# EAGLE design controller (EAGLE 9.5.2)

## Sheet 1 of 4: Main
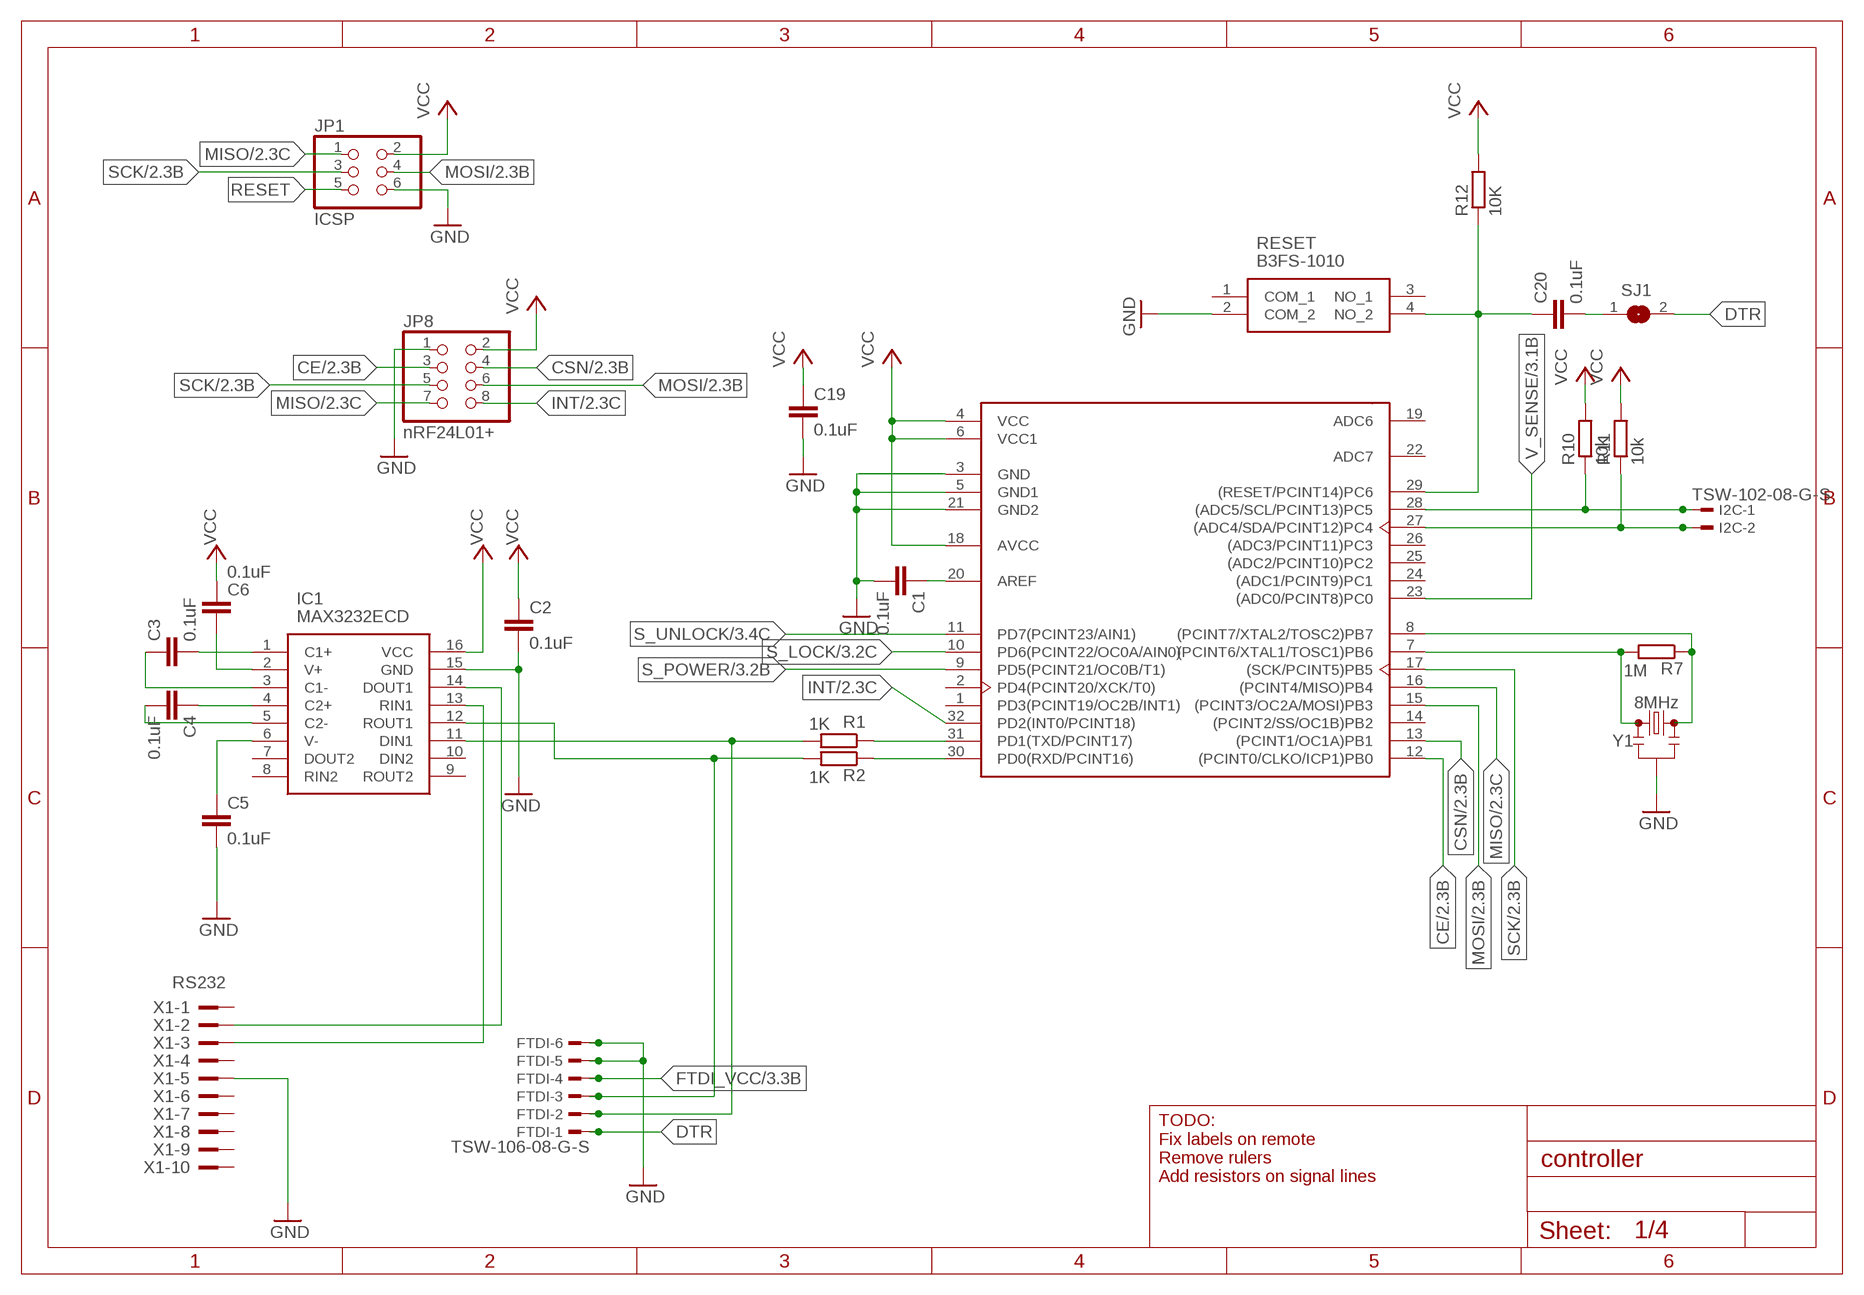
[diagram p0: schematic, sheet 1]

### Parts
C1  0.1uF  C-EUC0805  [C0805]
C2  0.1uF  C-EUC0805  [C0805]
C3  0.1uF  C-EUC0805  [C0805]
C4  0.1uF  C-EUC0805  [C0805]
C5  0.1uF  C-EUC0805  [C0805]
C6  0.1uF  C-EUC0805  [C0805]
C19  0.1uF  C-EUC0805  [C0805]
C20  0.1uF  C-EUC0805  [C0805]
FTDI  TSW-106-08-G-S  [TSW-106-XX-G-S]
I2C  TSW-102-08-G-S  [TSW-102-XX-G-S]
IC1  MAX3232ECD  [SOIC127P600X175-16N]
JP1  ICSP  PINHD-2X3  [2X03]
JP8  nRF24L01+  PINHD-2X4  [2X04]
R1  1K  R-EU_R0805  [R0805]
R2  1K  R-EU_R0805  [R0805]
R7  1M  R-EU_R0805  [R0805]
R10  10k  R-EU_R0805  [R0805]
R11  10k  R-EU_R0805  [R0805]
R12  10K  R-EU_R0805  [R0805]
RESET  B3FS-1010  [B3FS-1000P]
SJ1  SJ  [SJ]
U2  ATMEGA328P-AU  [TQFP-32]
X1  RS232  2510-  [PAK100/2500-10]
Y1  8MHz  RESONATOR-8MHZSMD_3.2X1.3  [RESONATOR-SMD-3.2X1.3]

### Nets
CE: JP8.3 U2.12((PCINT0/CLKO/ICP1)PB0) ; also sheet 2
CSN: JP8.4 U2.13((PCINT1/OC1A)PB1) ; also sheet 2
DTR: FTDI.1 SJ1.2
FTDI_VCC: FTDI.4 ; also sheet 3
GND: C1.2 C2.2 C5.2 C19.2 FTDI.5 FTDI.6 IC1.15(GND) JP1.6 JP8.1 RESET.2(COM_2) U2.3(GND) U2.5(GND1) U2.21(GND2) X1.5 Y1.2 ; also sheet 2,3
INT: JP8.8 U2.32(PD2(INT0/PCINT18)) ; also sheet 2
MISO: JP1.1 JP8.7 U2.16((PCINT4/MISO)PB4) ; also sheet 2
MOSI: JP1.4 JP8.6 U2.15((PCINT3/OC2A/MOSI)PB3) ; also sheet 2
N$1: C1.1 U2.20(AREF)
N$2: R7.2 U2.7((PCINT6/XTAL1/TOSC1)PB6) Y1.1
N$3: R7.1 U2.8((PCINT7/XTAL2/TOSC2)PB7) Y1.3
N$4: R1.1 U2.31(PD1(TXD/PCINT17))
N$5: R2.1 U2.30(PD0(RXD/PCINT16))
N$6: C5.1 IC1.6(V-)
N$7: C3.2 IC1.1(C1+)
N$8: C4.2 IC1.5(C2-)
N$9: C3.1 IC1.3(C1-)
N$10: C4.1 IC1.4(C2+)
N$11: C6.1 IC1.2(V+)
N$12: IC1.13(RIN1) X1.3
N$13: IC1.14(DOUT1) X1.2
N$28: C20.2 SJ1.1
RESET: C20.1 JP1.5 R12.1 RESET.4(NO_2) U2.29((RESET/PCINT14)PC6)
RX-I: FTDI.3 IC1.12(ROUT1) R2.2
S_LOCK: U2.10(PD6(PCINT22/OC0A/AIN0)) ; also sheet 3
S_POWER: U2.9(PD5(PCINT21/OC0B/T1)) ; also sheet 3
S_UNLOCK: U2.11(PD7(PCINT23/AIN1)) ; also sheet 3
SCK: JP1.3 JP8.5 U2.17((SCK/PCINT5)PB5) ; also sheet 2
SCL: I2C.1 R10.1 U2.28((ADC5/SCL/PCINT13)PC5)
SDA: I2C.2 R11.1 U2.27((ADC4/SDA/PCINT12)PC4)
TX-O: FTDI.2 IC1.11(DIN1) R1.2
V_SENSE: U2.23((ADC0/PCINT8)PC0) ; also sheet 3
VCC: C2.1 C6.2 C19.1 IC1.16(VCC) JP1.2 JP8.2 R10.2 R11.2 R12.2 U2.4(VCC) U2.6(VCC1) U2.18(AVCC) ; also sheet 2,3
Unconnected: IC1.7(DOUT2) IC1.8(RIN2) IC1.9(ROUT2) IC1.10(DIN2) RESET.1(COM_1) RESET.3(NO_1) U2.1(PD3(PCINT19/OC2B/INT1)) U2.2(PD4(PCINT20/XCK/T0)) U2.14((PCINT2/SS/OC1B)PB2) U2.19(ADC6) U2.22(ADC7) U2.24((ADC1/PCINT9)PC1) U2.25((ADC2/PCINT10)PC2) U2.26((ADC3/PCINT11)PC3) X1.1 X1.4 X1.6 X1.7 X1.8 X1.9 X1.10

### Notes on the sheet
- TODO:
  Fix labels on remote
  Remove rulers
  Add resistors on signal lines

## Sheet 2 of 4: Wireless
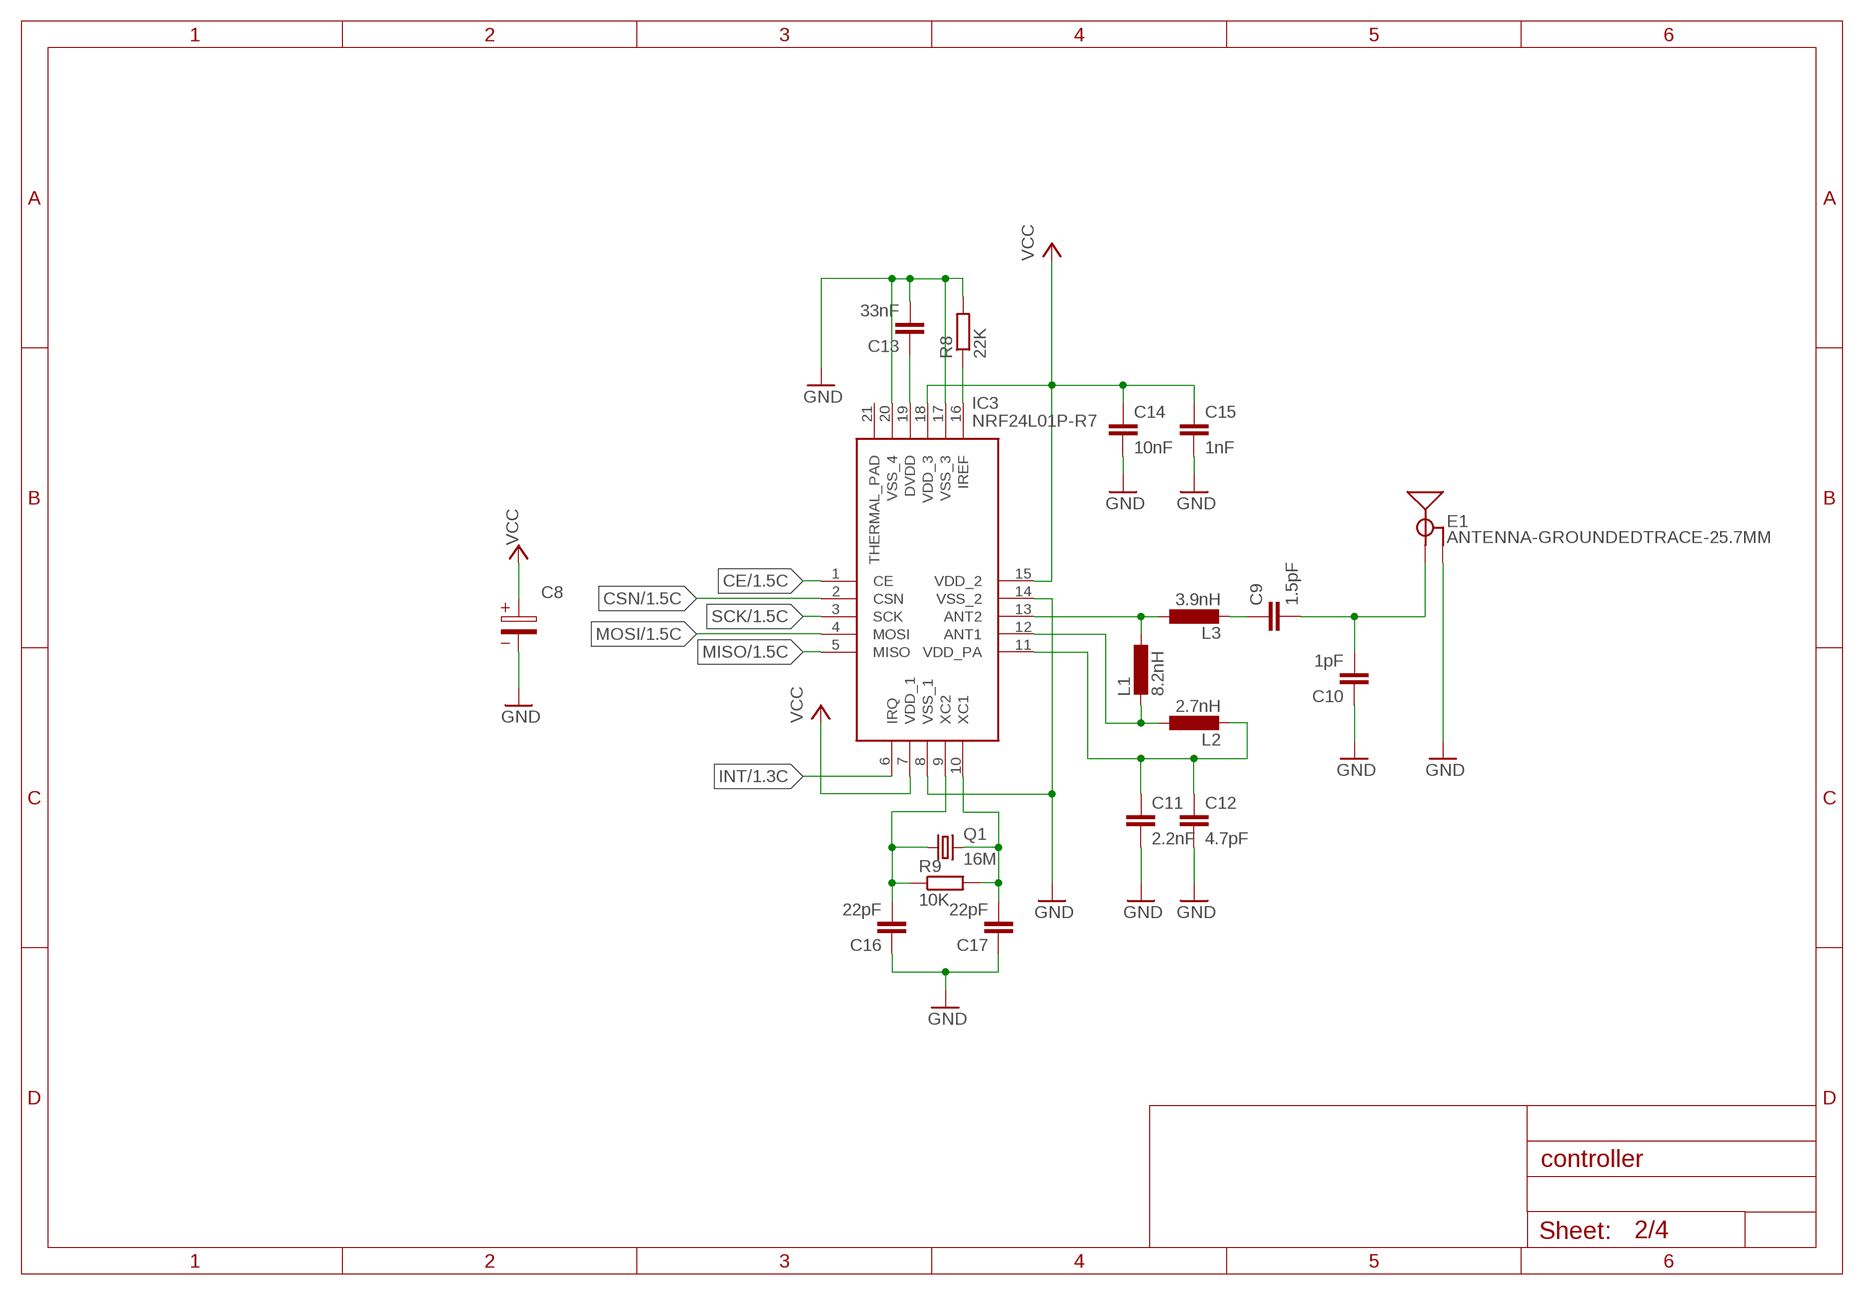
[diagram p1: schematic, sheet 2]

### Parts
C8  WCAP-ASLI_8X6,5_865080149011  [4.2X1.9X2.8(BXCXA)]
C9  1.5pF  C-EUC0805  [C0805]
C10  1pF  C-EUC0805  [C0805]
C11  2.2nF  C-EUC0805  [C0805]
C12  4.7pF  C-EUC0805  [C0805]
C13  33nF  C-EUC0805  [C0805]
C14  10nF  C-EUC0805  [C0805]
C15  1nF  C-EUC0805  [C0805]
C16  22pF  C-EUC0805  [C0805]
C17  22pF  C-EUC0805  [C0805]
E1  ANTENNA-GROUNDEDTRACE-25.7MM  [TRACE_ANTENNA_2.4GHZ_25.7MM]
IC3  NRF24L01P-R7  [QFN50P400X400X95-21N]
L1  8.2nH  L-EUL2012C  [L2012C]
L2  2.7nH  L-EUL2012C  [L2012C]
L3  3.9nH  L-EUL2012C  [L2012C]
Q1  16M  CRYSTALHC49S  [HC49/S]
R8  22K  R-EU_R0805  [R0805]
R9  10K  R-EU_R0805  [R0805]

### Nets
CE: IC3.1(CE) ; also sheet 1
CSN: IC3.2(CSN) ; also sheet 1
GND: C8.2 C10.1 C11.2 C12.2 C13.2 C14.2 C15.2 C16.1 C17.1 E1.GND E1.GND2(GND) IC3.8(VSS_1) IC3.14(VSS_2) IC3.17(VSS_3) IC3.20(VSS_4) R8.2 ; also sheet 1,3
INT: IC3.6(IRQ) ; also sheet 1
MISO: IC3.5(MISO) ; also sheet 1
MOSI: IC3.4(MOSI) ; also sheet 1
N$14: IC3.13(ANT2) L1.1 L3.1
N$15: IC3.12(ANT1) L1.2 L2.1
N$16: C11.1 C12.1 IC3.11(VDD_PA) L2.2
N$17: C9.1 L3.2
N$18: C9.2 C10.2 E1.ANT(SIGNAL)
N$19: C13.1 IC3.19(DVDD)
N$21: C16.2 IC3.9(XC2) Q1.1 R9.1
N$22: C17.2 IC3.10(XC1) Q1.2 R9.2
N$23: IC3.16(IREF) R8.1
SCK: IC3.3(SCK) ; also sheet 1
VCC: C8.1 C14.1 C15.1 IC3.7(VDD_1) IC3.15(VDD_2) IC3.18(VDD_3) ; also sheet 1,3
Unconnected: IC3.21(THERMAL_PAD)

## Sheet 3 of 4: Power / Control
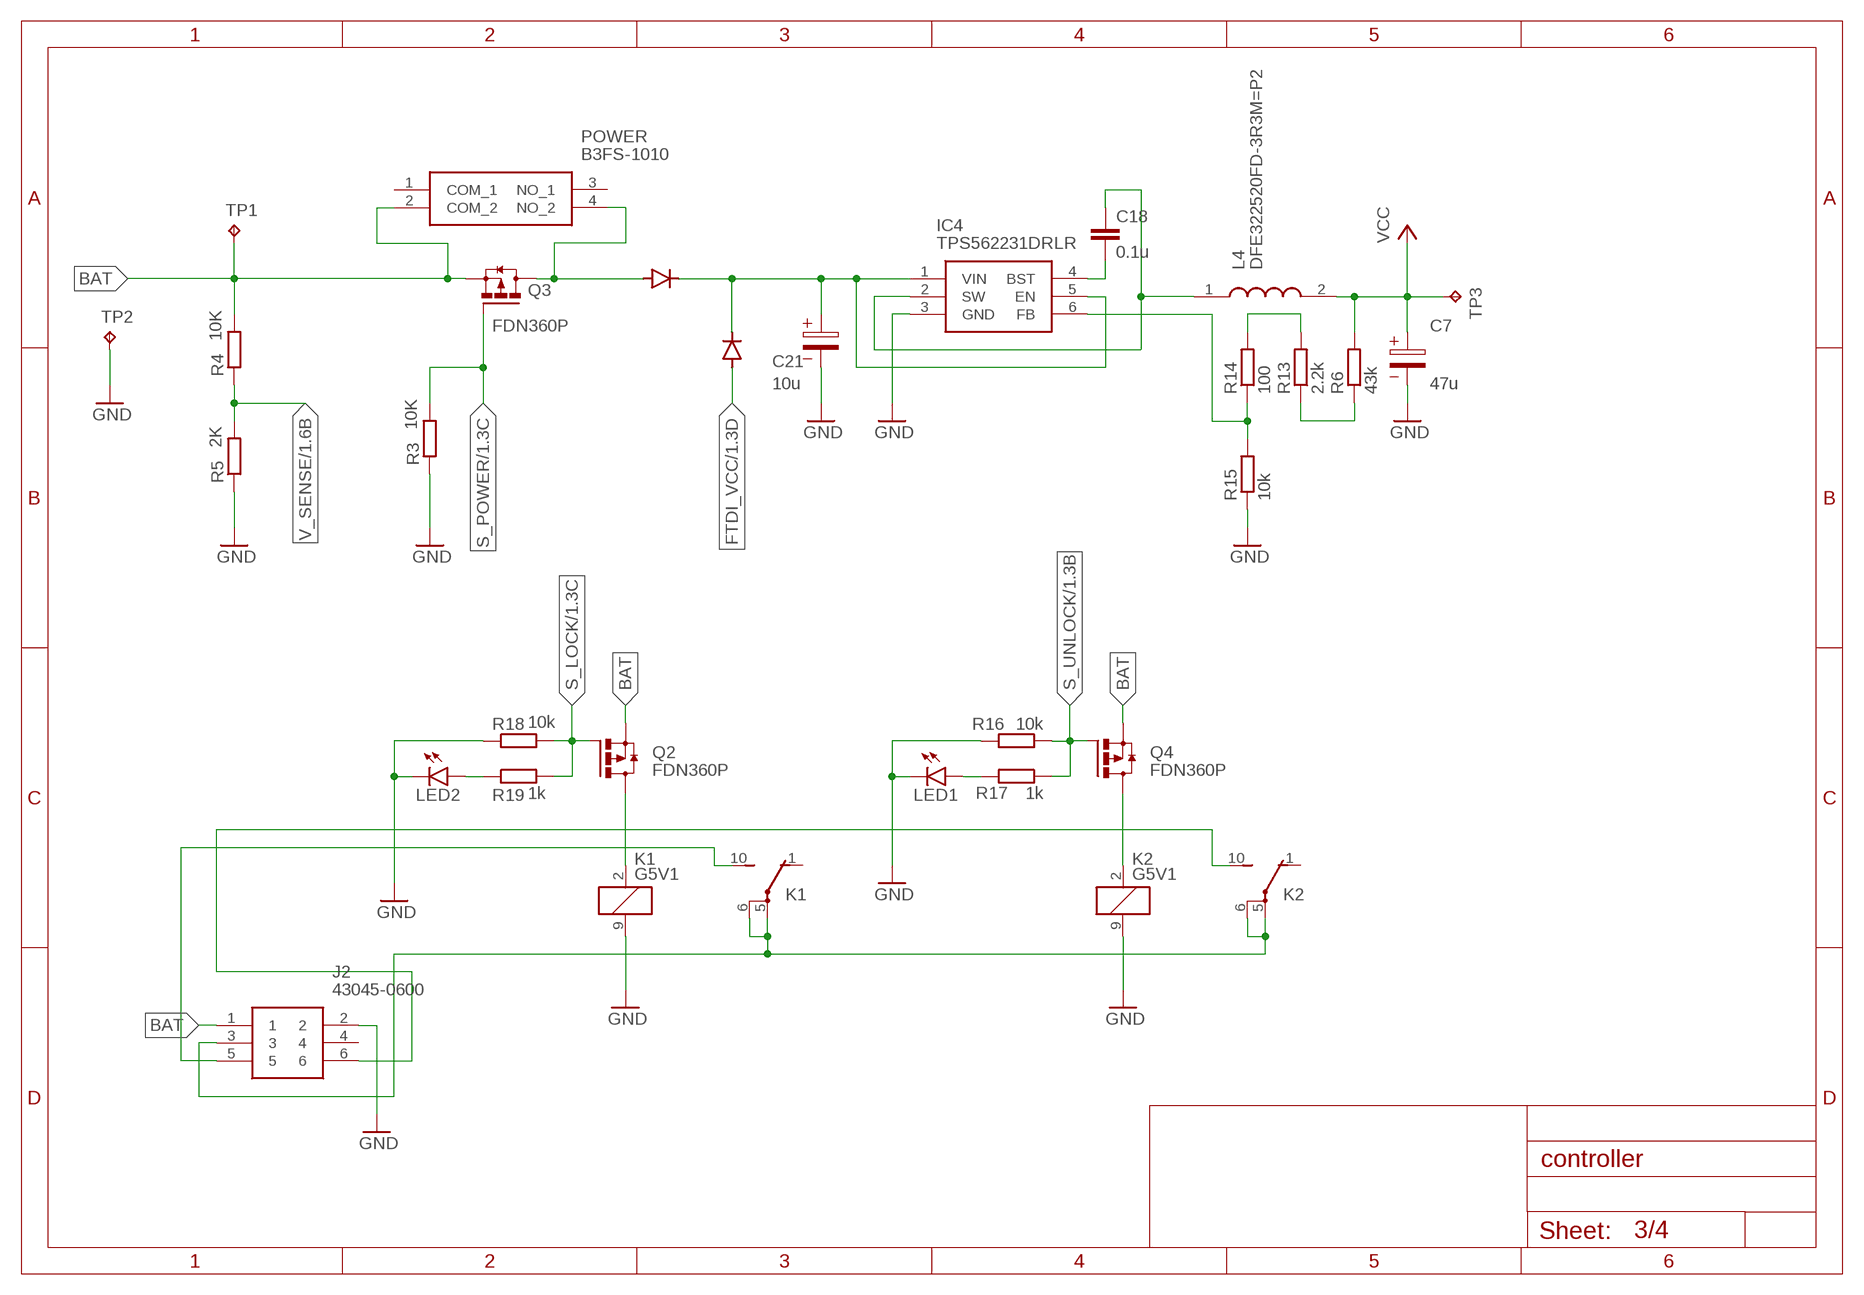
[diagram p2: schematic, sheet 3]

### Parts
C7  47u  WCAP-ASLI_4X5,5_865080140004  [2.6X1.6X1(BXCXA)]
C18  0.1u  C-EUC0805  [C0805]
C21  10u  WCAP-ASLI_4X5,5_865080340001  [2.6X1.6X1(BXCXA)]
D1  DIODE-SOD123  [SOD123]
D2  DIODE-SOD123  [SOD123]
IC4  TPS562231DRLR  [SOTFL50P160X60-6N]
J2  43045-0600  [43045-0600]
K1  G5V1  [G5V1]
K2  G5V1  [G5V1]
L4  DFE322520FD-3R3M=P2  [INDC3225X200N]
LED1  LEDCHIPLED_0805  [CHIPLED_0805]
LED2  LEDCHIPLED_0805  [CHIPLED_0805]
POWER  B3FS-1010  [B3FS-1000P]
Q2  FDN360P  [SUPER-SOT3]
Q3  FDN360P  [SUPER-SOT3]
Q4  FDN360P  [SUPER-SOT3]
R3  10K  R-EU_R0805  [R0805]
R4  10K  R-EU_R0805  [R0805]
R5  2K  R-EU_R0805  [R0805]
R6  43k  R-EU_R0805  [R0805]
R13  2.2k  R-EU_R0805  [R0805]
R14  100  R-EU_R0805  [R0805]
R15  10k  R-EU_R0805  [R0805]
R16  10k  R-EU_R0805  [R0805]
R17  1k  R-EU_R0805  [R0805]
R18  10k  R-EU_R0805  [R0805]
R19  1k  R-EU_R0805  [R0805]
TP1  TPB1,27  [B1,27]
TP2  TPB1,27  [B1,27]
TP3  TPB1,27  [B1,27]

### Nets
BAT: J2.1 POWER.2(COM_2) Q2.2(S) Q3.2(S) Q4.2(S) R4.2 TP1.TP
E_LOCK: J2.5 K1.10(2:S)
E_UNLOCK: J2.6 K2.10(2:S)
FTDI_VCC: D1.A ; also sheet 1
GND: C7.2 C21.2 IC4.3(GND) J2.2 K1.9 K2.9 LED1.C LED2.C R3.1 R5.1 R15.1 R16.2 R18.1 TP2.TP ; also sheet 1,2
N$24: C18.1 IC4.2(SW) L4.1
N$25: C18.2 IC4.4(BST)
N$26: R13.2 R14.2
N$27: C21.1 D1.C D2.C IC4.1(VIN) IC4.5(EN)
N$29: J2.3 K1.5(2:P) K1.6(2:P) K2.5(2:P) K2.6(2:P)
N$30: R6.1 R13.1
N$31: IC4.6(FB) R14.1 R15.2
N$33: D2.A POWER.4(NO_2) Q3.3(D)
N$34: K1.2 Q2.3(D)
N$35: K2.2 Q4.3(D)
N$37: LED1.A R17.2
N$39: LED2.A R19.1
S_LOCK: Q2.1(G) R18.2 R19.2 ; also sheet 1
S_POWER: Q3.1(G) R3.2 ; also sheet 1
S_UNLOCK: Q4.1(G) R16.1 R17.1 ; also sheet 1
V_SENSE: R4.1 R5.2 ; also sheet 1
VCC: C7.1 L4.2 R6.2 TP3.TP ; also sheet 1,2
Unconnected: J2.4 K1.1(2:O) K2.1(2:O) POWER.1(COM_1) POWER.3(NO_1)

## Sheet 4 of 4: Remote
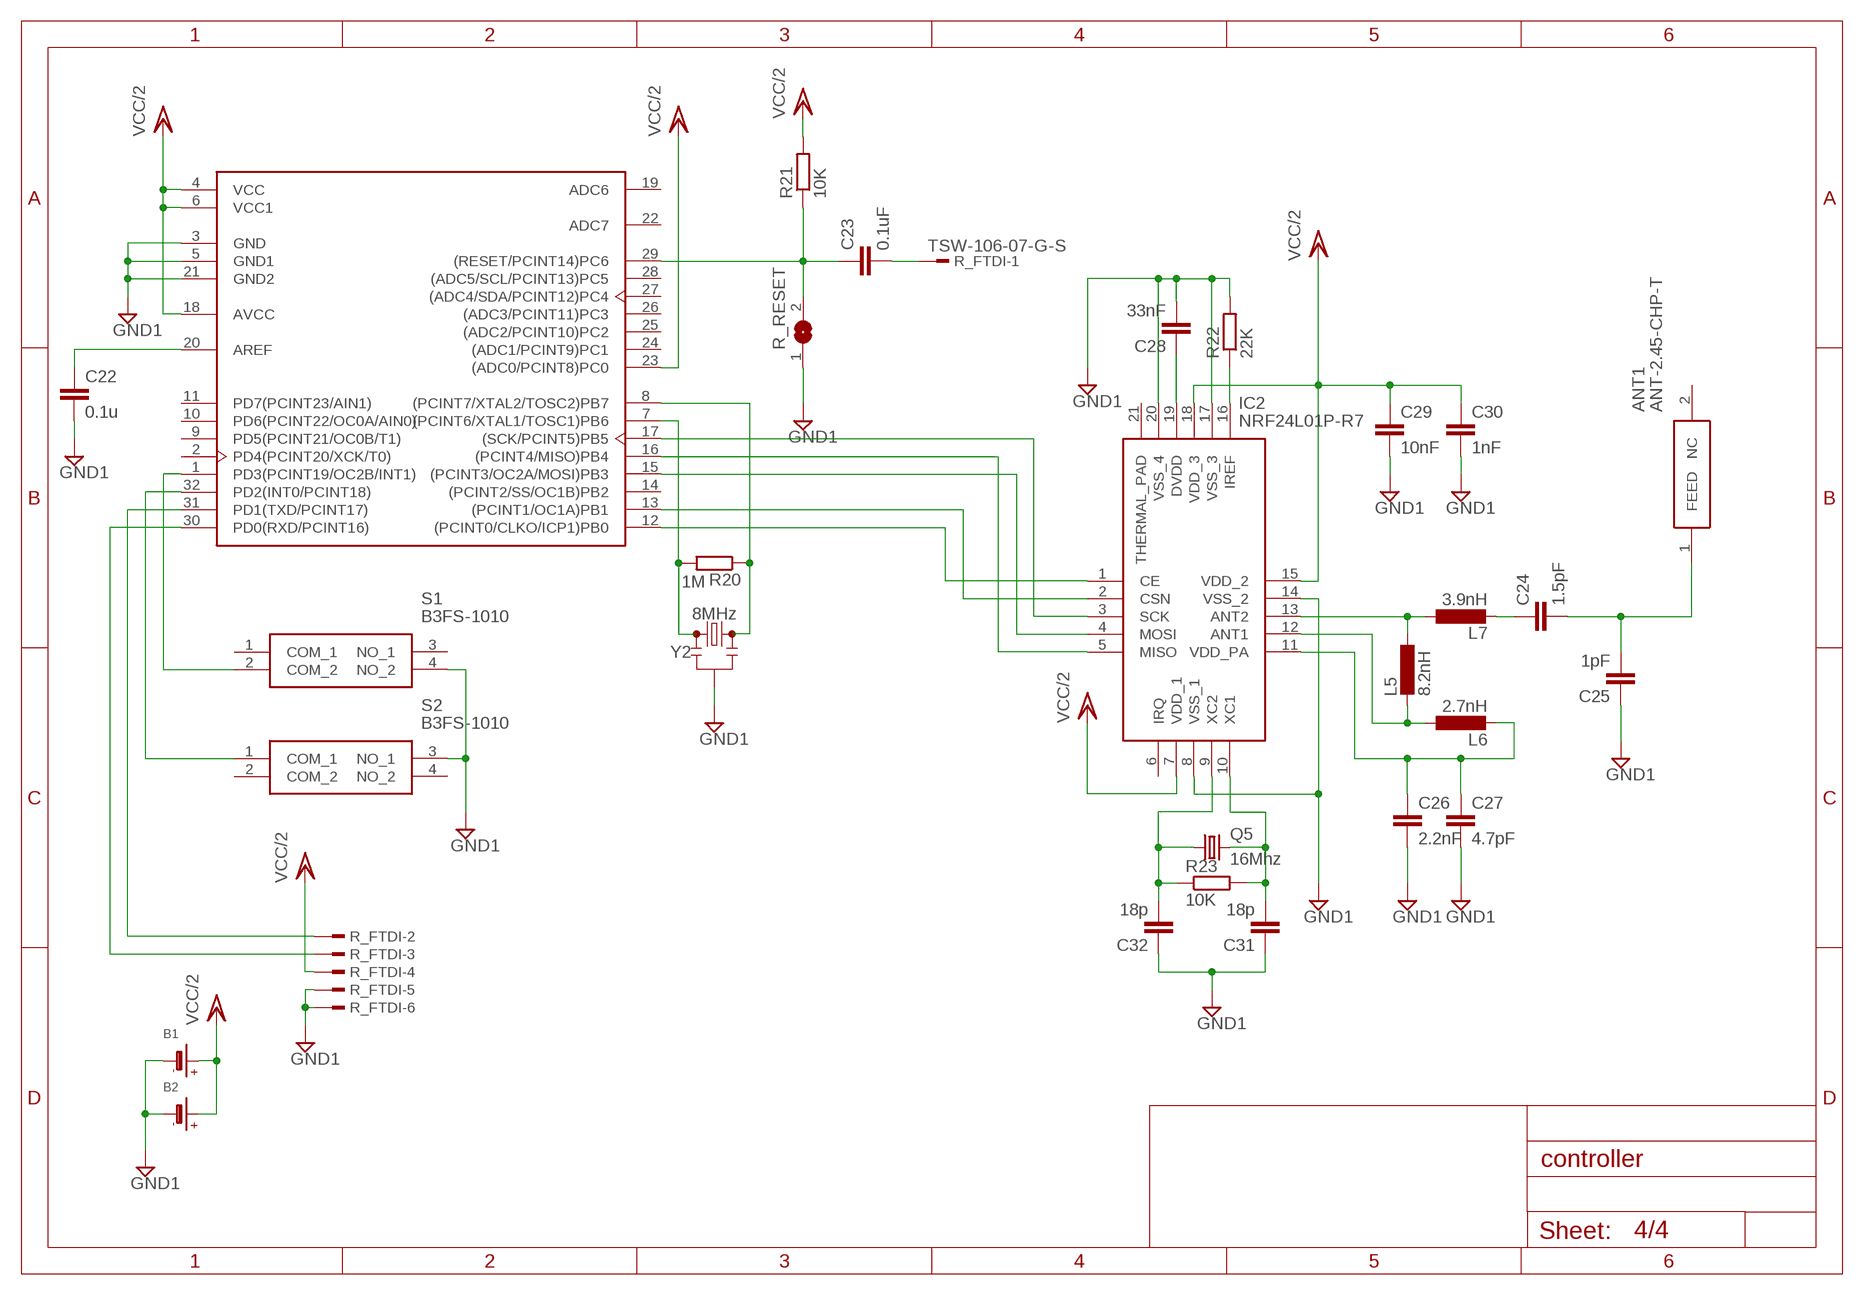
[diagram p3: schematic, sheet 4]

### Parts
ANT1  ANT-2.45-CHP-T  [ANT-2.45-CHP-T]
B1  BATTERYCR2032_BAT-HLD-001  [CR2032_SMT_BAT-HLD-001]
B2  BATTERYCR2032_BAT-HLD-001  [CR2032_SMT_BAT-HLD-001]
C22  0.1u  C-EUC0805  [C0805]
C23  0.1uF  C-EUC0805  [C0805]
C24  1.5pF  C-EUC0805  [C0805]
C25  1pF  C-EUC0805  [C0805]
C26  2.2nF  C-EUC0805  [C0805]
C27  4.7pF  C-EUC0805  [C0805]
C28  33nF  C-EUC0805  [C0805]
C29  10nF  C-EUC0805  [C0805]
C30  1nF  C-EUC0805  [C0805]
C31  18p  C-EUC0805  [C0805]
C32  18p  C-EUC0805  [C0805]
IC2  NRF24L01P-R7  [QFN50P400X400X95-21N]
L5  8.2nH  L-EUL2012C  [L2012C]
L6  2.7nH  L-EUL2012C  [L2012C]
L7  3.9nH  L-EUL2012C  [L2012C]
Q5  16Mhz  CRYSTALHC49UP  [HC49UP]
R20  1M  R-EU_R0805  [R0805]
R21  10K  R-EU_R0805  [R0805]
R22  22K  R-EU_R0805  [R0805]
R23  10K  R-EU_R0805  [R0805]
R_FTDI  TSW-106-07-G-S  [TSW-106-XX-G-S]
R_RESET  SJ  [SJ]
S1  B3FS-1010  [B3FS-1000P]
S2  B3FS-1010  [B3FS-1000P]
U1  ATMEGA328P-AU  [TQFP-32]
Y2  8MHz  RESONATOR-8MHZSMD_3.2X1.3  [RESONATOR-SMD-3.2X1.3]

### Nets
GND1: B1.- B2.- C22.2 C25.1 C26.2 C27.2 C28.2 C29.2 C30.2 C31.1 C32.1 IC2.8(VSS_1) IC2.14(VSS_2) IC2.17(VSS_3) IC2.20(VSS_4) R22.2 R_FTDI.5 R_FTDI.6 R_RESET.1 S1.4(NO_2) S2.3(NO_1) U1.3(GND) U1.5(GND1) U1.21(GND2) Y2.2
N$20: R20.2 U1.7((PCINT6/XTAL1/TOSC1)PB6) Y2.1
N$32: R20.1 U1.8((PCINT7/XTAL2/TOSC2)PB7) Y2.3
N$36: C22.1 U1.20(AREF)
N$38: S1.2(COM_2) U1.1(PD3(PCINT19/OC2B/INT1))
N$40: S2.1(COM_1) U1.32(PD2(INT0/PCINT18))
N$41: C23.2 R_FTDI.1
N$42: C23.1 R21.1 R_RESET.2 U1.29((RESET/PCINT14)PC6)
N$43: IC2.13(ANT2) L5.1 L7.1
N$44: R_FTDI.2 U1.31(PD1(TXD/PCINT17))
N$45: R_FTDI.3 U1.30(PD0(RXD/PCINT16))
N$46: IC2.12(ANT1) L5.2 L6.1
N$47: C26.1 C27.1 IC2.11(VDD_PA) L6.2
N$48: C24.1 L7.2
N$49: ANT1.1(FEED) C24.2 C25.2
N$50: C32.2 IC2.9(XC2) Q5.1 R23.1
N$51: C31.2 IC2.10(XC1) Q5.2 R23.2
N$52: IC2.16(IREF) R22.1
N$53: C28.1 IC2.19(DVDD)
N$54: IC2.3(SCK) U1.17((SCK/PCINT5)PB5)
N$55: IC2.5(MISO) U1.16((PCINT4/MISO)PB4)
N$56: IC2.4(MOSI) U1.15((PCINT3/OC2A/MOSI)PB3)
N$57: IC2.2(CSN) U1.13((PCINT1/OC1A)PB1)
N$58: IC2.1(CE) U1.12((PCINT0/CLKO/ICP1)PB0)
VCC/2: B1.+$1(+) B1.+$2(+) B2.+$1(+) B2.+$2(+) C29.1 C30.1 IC2.7(VDD_1) IC2.15(VDD_2) IC2.18(VDD_3) R21.2 R_FTDI.4 U1.4(VCC) U1.6(VCC1) U1.18(AVCC) U1.23((ADC0/PCINT8)PC0)
Unconnected: ANT1.2(NC) IC2.6(IRQ) IC2.21(THERMAL_PAD) S1.1(COM_1) S1.3(NO_1) S2.2(COM_2) S2.4(NO_2) U1.2(PD4(PCINT20/XCK/T0)) U1.9(PD5(PCINT21/OC0B/T1)) U1.10(PD6(PCINT22/OC0A/AIN0)) U1.11(PD7(PCINT23/AIN1)) U1.14((PCINT2/SS/OC1B)PB2) U1.19(ADC6) U1.22(ADC7) U1.24((ADC1/PCINT9)PC1) U1.25((ADC2/PCINT10)PC2) U1.26((ADC3/PCINT11)PC3) U1.27((ADC4/SDA/PCINT12)PC4) U1.28((ADC5/SCL/PCINT13)PC5)

## Library data of the parts
ANT1 = ANT-2.45-CHP-T:ANT-2.45-CHP-T: Antennas 2.45GHz Chip Ant. Source: Datasheet <https://componentsearchengine.com/Datasheets/1/ANT-2.45-CHP-T.pdf>; DESCRIPTION: Antennas 2.45GHz Chip Ant.; HEIGHT: mm; MANUFACTURER_NAME: Linx Technologies; MANUFACTURER_PART_NUMBER: ANT-2.45-CHP-T; MOUSER_PART_NUMBER: 712-ANT-2.45-CHP-T; MOUSER_PRICE-STOCK: https://www.mouser.com/Search/Refine.aspx?Keyword=712-ANT-2.45-CHP-T
B1 B2 = fse_custom:BATTERY: CR1220 SMT - Digikey: 3001K-ND CD2032 BAT-HLD-001 - Digikey: BAT-HLD-001-ND
C1-C6 C18-C20 C22 C23 = rcl:C-EU: CAPACITOR, European symbol; SPICEPREFIX: C
C7 = Wurth_Elektronik_Passive_Capacitors_rev18b:WCAP-ASLI: WCAP-ASLI Aluminum Electrolytic Capacitors Characteristics Aluminum Electrolytic Capacitor Recommended soldering: Reflow Operating temperature: -55 °C to +105 °C Low impedance product series Load life:2000 h @ +105 °C Package name and Variant abbreviation: Package: Package: B X C X A = length of the solder pad X width of the solder pad X pitch of the solder pad. <http://katalog.we-online.de/media/images/eisos/WCAP-ASLI_pf2.jpg> Details see: http://katalog.we-online.de/en/pbs/WCAP-ASLI Updated by: Yingchun,Shan Updated: 2017-03-16 2017 (C) Wurth Elektronik; WE-NUMBER: 865080140004/47uF
C8 = Wurth_Elektronik_Passive_Capacitors_rev18b:WCAP-ASLI: WCAP-ASLI Aluminum Electrolytic Capacitors Characteristics Aluminum Electrolytic Capacitor Recommended soldering: Reflow Operating temperature: -55 °C to +105 °C Low impedance product series Load life:2000 h @ +105 °C Package name and Variant abbreviation: Package: Package: B X C X A = length of the solder pad X width of the solder pad X pitch of the solder pad. <http://katalog.we-online.de/media/images/eisos/WCAP-ASLI_pf2.jpg> Details see: http://katalog.we-online.de/en/pbs/WCAP-ASLI Updated by: Yingchun,Shan Updated: 2017-03-16 2017 (C) Wurth Elektronik; WE-NUMBER: 865080149011/330uF
C9-C17 C24-C32 = resistor:C-EU: CAPACITOR, European symbol
C21 = Wurth_Elektronik_Passive_Capacitors_rev18b:WCAP-ASLI: WCAP-ASLI Aluminum Electrolytic Capacitors Characteristics Aluminum Electrolytic Capacitor Recommended soldering: Reflow Operating temperature: -55 °C to +105 °C Low impedance product series Load life:2000 h @ +105 °C Package name and Variant abbreviation: Package: Package: B X C X A = length of the solder pad X width of the solder pad X pitch of the solder pad. <http://katalog.we-online.de/media/images/eisos/WCAP-ASLI_pf2.jpg> Details see: http://katalog.we-online.de/en/pbs/WCAP-ASLI Updated by: Yingchun,Shan Updated: 2017-03-16 2017 (C) Wurth Elektronik; WE-NUMBER: 865080340001/10uF
D1 D2 = diode:DIODE-: DIODE
E1 = SparkFun-RF:ANTENNA-GROUNDED: Antenna w/ Ground Connection 2.4GHz antennae with signal and ground terminals. TRACE_ANTENNA_2.4GHZ_15.2MM - Meander Trace antenna 15.2 x 5.7mm footprint Based on layout from TI app note AN043 <http://www.ti.com/lit/an/swra117d/swra117d.pdf>. TRACE_ANTENNA_2.4GHZ_25.7MM - Inverted F trace antenna 25.7 x 7.5 mm footprint. Based on layout from TI design note DN0007 <http://www.ti.com/lit/an/swru120b/swru120b.pdf>.
FTDI R_FTDI = con-samtec:TSW-106-*-G-S: THROUGH-HOLE .025" SQ POST HEADER Source: Samtec TSW.pdf; MF: Samtec Inc.; MPN: TSW-106-07-G-S
I2C = con-samtec:TSW-102-*-G-S: THROUGH-HOLE .025" SQ POST HEADER Source: Samtec TSW.pdf; MF: Samtec Inc.; MPN: TSW-102-07-G-S
IC1 = MAX3232ECD:MAX3232ECD: Texas Instruments MAX3232ECD, Dual Line Transceiver, EIA/TIA-232-F/ RS-232/ V.28 2-TX 2-RX 2-TRX, 3.3 V, 5 V, 16-Pin Source: Datasheet <http://www.ti.com/lit/gpn/max3232e>; DESCRIPTION: Texas Instruments MAX3232ECD, Dual Line Transceiver, EIA/TIA-232-F/ RS-232/ V.28 2-TX 2-RX 2-TRX, 3.3 V, 5 V, 16-Pin; HEIGHT: 1.75mm; MANUFACTURER_NAME: Texas Instruments; MANUFACTURER_PART_NUMBER: MAX3232ECD; MOUSER_PART_NUMBER: 595-MAX3232ECD; MOUSER_PRICE-STOCK: https://www.mouser.com/Search/Refine.aspx?Keyword=595-MAX3232ECD; RS_PART_NUMBER: 6608704P; RS_PRICE-STOCK: http://uk.rs-online.com/web/p/products/6608704P
IC2 IC3 = NRF24L01P-R7:NRF24L01P-R7: NORDIC SEMICONDUCTOR - NRF24L01P-R7 - RF TRANSCEIVER, 2MBPS, 2.525GHZ, QFN-20 Source: Datasheet <https://www.mouser.com/ds/2/297/nRF24L01P-1187709.pdf>; DESCRIPTION: NORDIC SEMICONDUCTOR - NRF24L01P-R7 - RF TRANSCEIVER, 2MBPS, 2.525GHZ, QFN-20; HEIGHT: 0.95mm; MANUFACTURER_NAME: Nordic Semiconductor; MANUFACTURER_PART_NUMBER: NRF24L01P-R7; MOUSER_PART_NUMBER: 949-NRF24L01P-R7; MOUSER_PRICE-STOCK: https://www.mouser.com/Search/Refine.aspx?Keyword=949-NRF24L01P-R7
IC4 = TPS562231DRLR:TPS562231DRLR: 4.5-V to 17-V input, 2-A output, synchronous step-down converter Source: Datasheet <http://www.ti.com/lit/gpn/TPS562231>; DESCRIPTION: 4.5-V to 17-V input, 2-A output, synchronous step-down converter; HEIGHT: 0.6mm; MANUFACTURER_NAME: Texas Instruments; MANUFACTURER_PART_NUMBER: TPS562231DRLR; MOUSER_PART_NUMBER: 595-TPS562231DRLR; MOUSER_PRICE-STOCK: https://www.mouser.com/Search/Refine.aspx?Keyword=595-TPS562231DRLR
J2 = 43045-0600:43045-0600: 6 way dual row r/a header,5A 250Vac 3mm Molex MICRO-FIT 3.0 Series, Series Number 43045, 3mm Pitch 6 Way 2 Row Right Angle PCB Header, Solder Termination, 5A Source: Datasheet <http://www.molex.com/webdocs/datasheets/pdf/en-us/0430450600_PCB_HEADERS.pdf>; ALLIED_NUMBER: 70090796; ALLIED_PRICE-STOCK: http://www.alliedelec.com/molex-incorporated-43045-0600/70090796/; DESCRIPTION: 6 way dual row r/a header,5A 250Vac 3mm Molex MICRO-FIT 3.0 Series, Series Number 43045, 3mm Pitch 6 Way 2 Row Right Angle PCB Header, Solder Termination, 5A; HEIGHT: mm; MANUFACTURER_NAME: Molex; MANUFACTURER_PART_NUMBER: 43045-0600; MOUSER_PART_NUMBER: 538-43045-0600; MOUSER_PRICE-STOCK: https://www.mouser.com/Search/Refine.aspx?Keyword=538-43045-0600; RS_PART_NUMBER: 2332961P; RS_PRICE-STOCK: http://uk.rs-online.com/web/p/products/2332961P
JP1 = pinhead:PINHD-2X3: PIN HEADER
JP8 = pinhead:PINHD-2X4: PIN HEADER
K1 K2 = relay:G5V1: RELAY 1 x switch, 0.5 A/125 V AC, 1 A/24 V DC , Omron; MPN: G5V-1-DC24; OC_FARNELL: 9949593; OC_NEWARK: 36M6377
L1-L3 L5-L7 = rcl:L-EU: INDUCTOR, European symbol; SPICEPREFIX: L
L4 = DFE322520FD-3R3M=P2:DFE322520FD-3R3M=P2: DFE322520F_D Series Inductor 3.3uH +/-20% 1210 (3225) Source: Datasheet <https://psearch.en.murata.com/inductor/product/DFE322520FD-3R3M#.html>; DESCRIPTION: DFE322520F_D Series Inductor 3.3uH +/-20% 1210 (3225); HEIGHT: 2mm; MANUFACTURER_NAME: Murata Electronics; MANUFACTURER_PART_NUMBER: DFE322520FD-3R3M=P2; MOUSER_PART_NUMBER: 81-DFE322520FD3R3MP2; MOUSER_PRICE-STOCK: https://www.mouser.com/Search/Refine.aspx?Keyword=81-DFE322520FD3R3MP2
LED1 LED2 = led:LED: LED OSRAM: - CHIPLED LG R971, LG N971, LY N971, LG Q971, LY Q971, LO R971, LY R971 LH N974, LH R974 LS Q976, LO Q976, LY Q976 LO Q996 - Hyper CHIPLED LW Q18S LB Q993, LB Q99A, LB R99A - SideLED LS A670, LO A670, LY A670, LG A670, LP A670 LB A673, LV A673, LT A673, LW A673 LH A674 LY A675 LS A676, LA A676, LO A676, LY A676, LW A676 LS A679, LY A679, LG A679 - Hyper Micro SIDELED® LS Y876, LA Y876, LO Y876, LY Y876 LT Y87S - SmartLED LW L88C, LW L88S LB L89C, LB L89S, LG L890 LS L89K, LO L89K, LY L89K LS L896, LA L896, LO L896, LY L896 - TOPLED LS T670, LO T670, LY T670, LG T670, LP T670 LSG T670, LSP T670, LSY T670, LOP T670, LYG T670 LG T671, LOG T671, LSG T671 LB T673, LV T673, LT T673, LW T673 LH T674 LS T676, LA T676, LO T676, LY T676, LB T676, LH T676, LSB T676, LW T676 LB T67C, LV T67C, LT T67C, LS T67K, LO T67K, LY T67K, LW E67C LS E67B, LA E67B, LO E67B, LY E67B, LB E67C, LV E67C, LT E67C LW T67C LS T679, LY T679, LG T679 LS T770, LO T770, LY T770, LG T770, LP T770 LB T773, LV T773, LT T773, LW T773 LH T774 LS E675, LA E675, LY E675, LS T675 LS T776, LA T776, LO T776, LY T776, LB T776 LHGB T686 LT T68C, LB T68C - Hyper Mini TOPLED® LB M676 - Mini TOPLED Santana® LG M470 LS M47K, LO M47K, LY M47K Source: http://www.osram.convergy.de LUXEON: - LUMILED® LXK2-PW12-R00, LXK2-PW12-S00, LXK2-PW14-U00, LXK2-PW14-V00 LXK2-PM12-R00, LXK2-PM12-S00, LXK2-PM14-U00 LXK2-PE12-Q00, LXK2-PE12-R00, LXK2-PE12-S00, LXK2-PE14-T00, LXK2-PE14-U00 LXK2-PB12-K00, LXK2-PB12-L00, LXK2-PB12-M00, LXK2-PB14-N00, LXK2-PB14-P00, LXK2-PB14-Q00 LXK2-PR12-L00, LXK2-PR12-M00, LXK2-PR14-Q00, LXK2-PR14-R00 LXK2-PD12-Q00, LXK2-PD12-R00, LXK2-PD12-S00 LXK2-PH12-R00, LXK2-PH12-S00 LXK2-PL12-P00, LXK2-PL12-Q00, LXK2-PL12-R00 Source: www.luxeon.com KINGBRIGHT: KA-3528ASYC Source: www.kingbright.com
POWER RESET S1 S2 = B3FS-1010:B3FS-1010: Plunger Tactile Switch, SPST-NO 50 mA @ 24 V dc 1.7mm Source: Datasheet <https://omronfs.omron.com/en_US/ecb/products/pdf/en-b3fs.pdf>; DESCRIPTION: Plunger Tactile Switch, SPST-NO 50 mA @ 24 V dc 1.7mm; HEIGHT: mm; MANUFACTURER_NAME: Omron Electronics; MANUFACTURER_PART_NUMBER: B3FS-1010; MOUSER_PART_NUMBER: 653-B3FS-1010; MOUSER_PRICE-STOCK: https://www.mouser.com/Search/Refine.aspx?Keyword=653-B3FS-1010; RS_PART_NUMBER: 6821266P; RS_PRICE-STOCK: http://uk.rs-online.com/web/p/products/6821266P
Q1 = crystal:CRYSTAL: CRYSTAL; OC_FARNELL: 1667008; OC_NEWARK: unknown
Q2-Q4 = transistor-power:FDN360P: Single P-Channel, PowerTrench (R) MOSFET Source: http://www.fairchildsemi.com/ds/FD/FDN360P.pdf
Q5 = crystal:CRYSTAL: CRYSTAL; OC_FARNELL: unknown; OC_NEWARK: unknown
R1-R23 = rcl:R-EU_: RESISTOR, European symbol; SPICEPREFIX: R
R_RESET SJ1 = jumper:SJ: SMD solder JUMPER
TP1-TP3 = testpad:TP: Test pad
U1 U2 = Microcontroller:ATMEGA328P-AU: IC MCU 8BIT 32KB FLASH 32TQFP Manufacturer's datasheet <http://ww1.microchip.com/downloads/en/DeviceDoc/ATmega48A-PA-88A-PA-168A-PA-328-P-DS-DS40002061A.pdf>; CREATED_BY: PCBLayout.com; DIGIKEY_PART_NUMBER: ATMEGA328P-AU-ND; MANUFACTURER: Microchip Technology; MPN: ATMEGA328P-AU; PACKAGE: TQFP-32
X1 = con-3m:2510-: 3M (TM) Pak 100 4-Wall Header Source: 3M; MF: 3M; MPN: 2510-6002UB; OC_FARNELL: 9838244; OC_NEWARK: 46F4725
Y1 Y2 = SparkFun-Clocks:RESONATOR-8MHZ: 8MHz Resonator Digikey Example <http://www.digikey.com/product-detail/en/murata-electronics-north-america/CSTCE10M0G55-R0/490-1196-1-ND/584633> Frequency: 8MHz Frequency Stability: ±0.2% Frequency Tolerance: ±0.5% Capacitance: 33pF SparkFun Products Arduino Pro Mini 328- 3.3V/8MHz <https://www.sparkfun.com/products/11114> SparkFun Digital Sandbox <https://www.sparkfun.com/products/12651>; PROD_ID: XTAL-08895

## Board
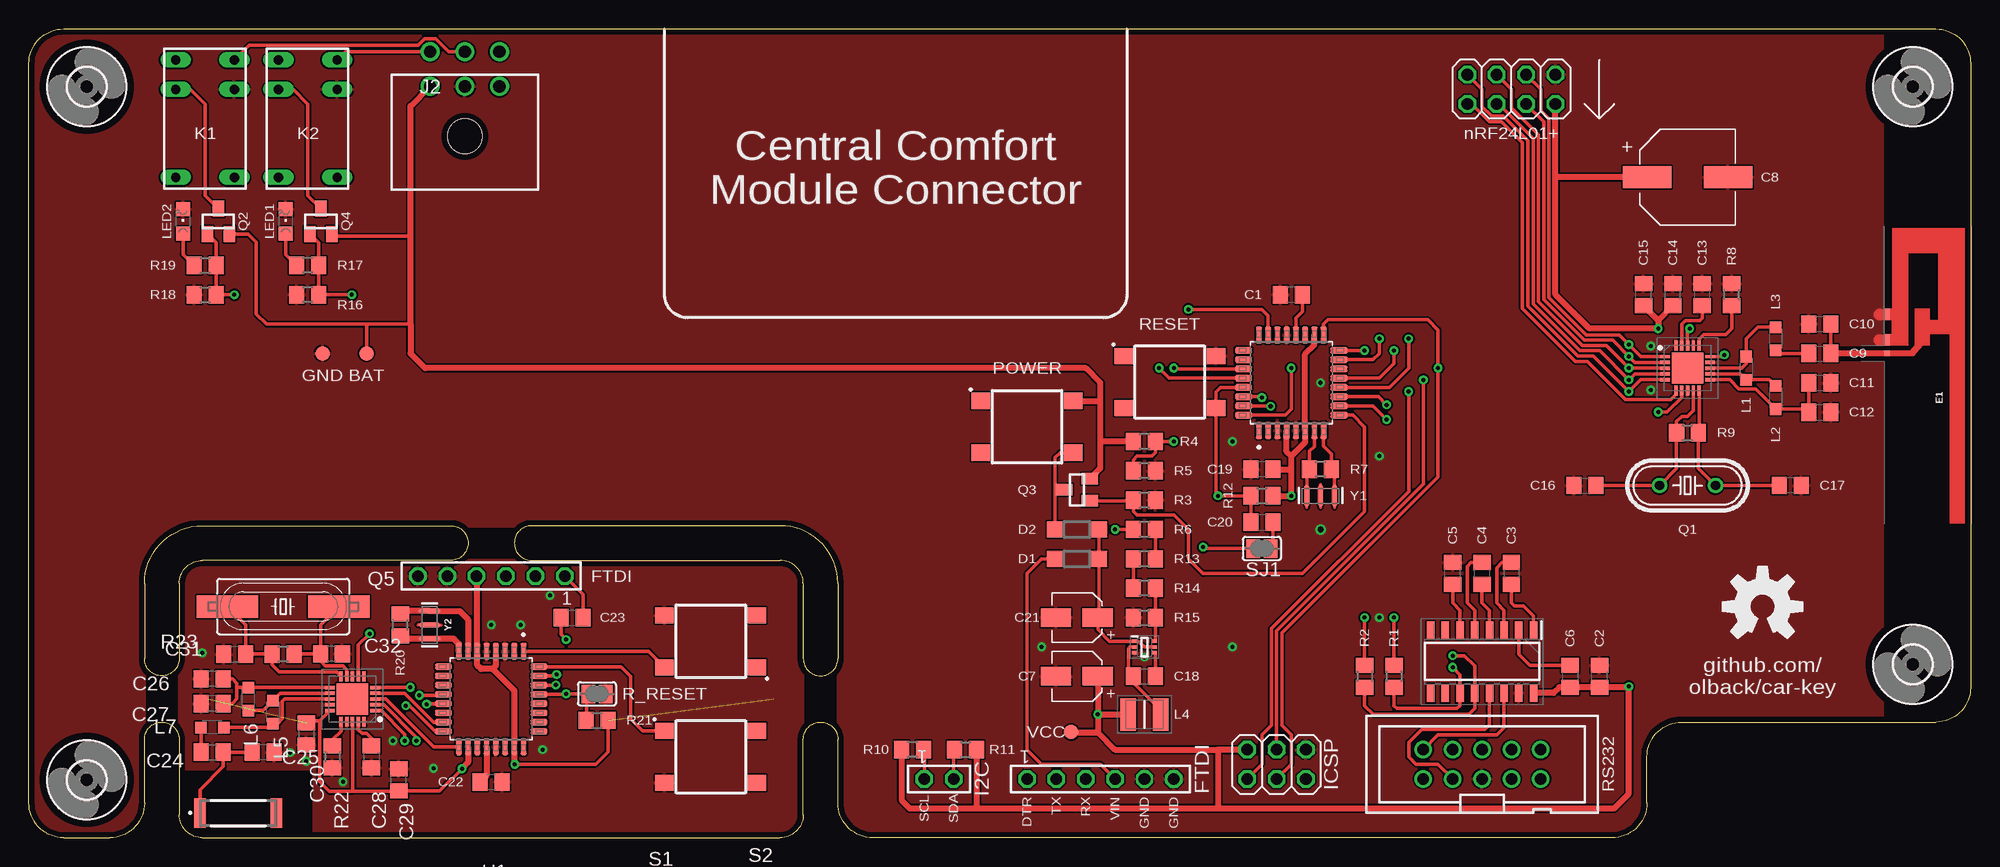
[diagram p4: board, top side]
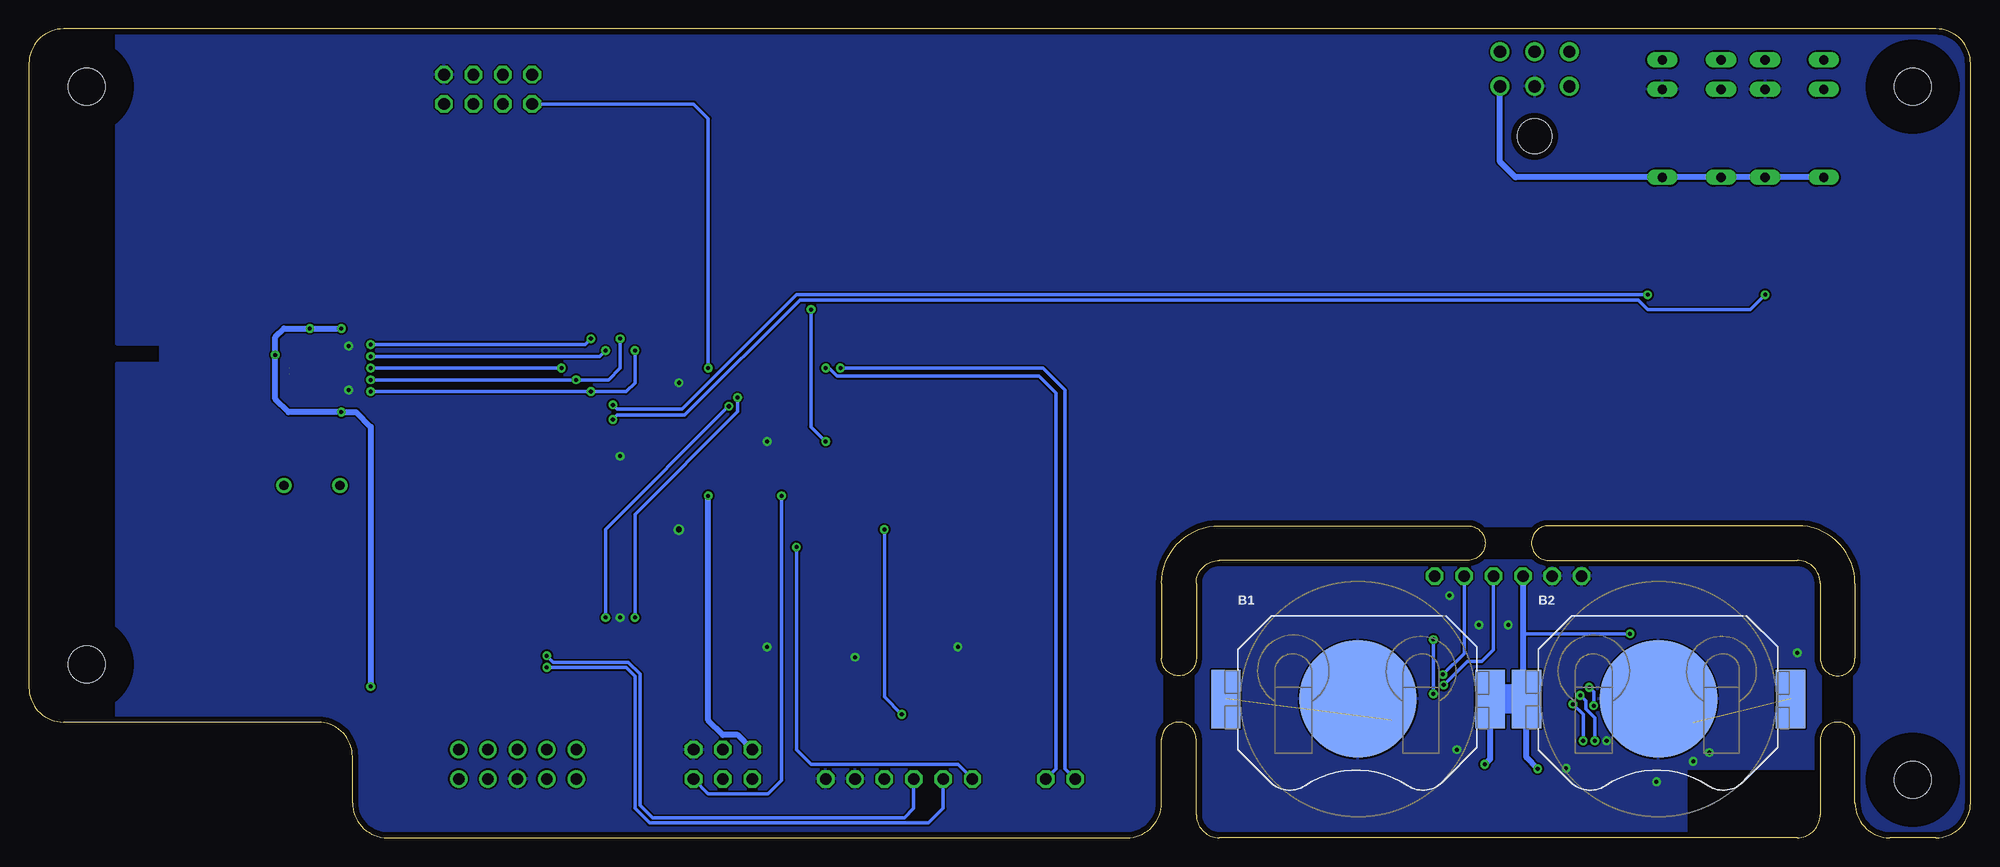
[diagram p5: board, bottom side, seen from below]

Size 168 x 70 mm. Coordinates in mm from the lower left corner, seen from the top.
Outline: 165,70 arc-90 168,67 168,13 arc-90 165,10 143,10 arc90 140,7 140,3 arc-90 137,0 73,0 arc-90 70,3 70,8.5 arc180 67,8.5 67,2 arc-90 65,0 15,0 arc-90 13,2 13,8.5 arc180 10,8.5 10,3 arc-90 7,0 3,0 arc-90 0,3 0,67 arc-90 3,70 165,70
Outline: 67,15.5 arc180 70,15.5 70,22 arc90 65,27 43.5,27 arc180 43.5,24 65,24 arc-90 67,22 67,15.5
Outline: 13,15.5 arc-180 10,15.5 10,22 arc-90 15,27 36.5,27 arc-180 36.5,24 15,24 arc90 13,22 13,15.5
Copper layers (1*16): Top 0.035mm / dielectric 1.5mm / Bottom 0.035mm
Design rules "default *": minimum track width 10mil, minimum drill 0.35mm, track to track 6mil, track to pad 6mil, pad to pad 6mil, via to via 6mil, smd to smd 6mil, copper to edge 20mil, drill to drill 8mil, minimum pad ring 10mil, minimum via ring 8mil, stop-mask expansion 4mil, vias tented up to drill 0mil, thermal gap 6mil
Milling: 16 lines

### Footprints (pad centres in the part's own frame; a part is rotated, then mirrored left to right if it is on the bottom)
ANT-2.45-CHP-T = smd 1.016 x 2.54: 1 -3.302,0; 2 3.302,0
CR2032_SMT_BAT-HLD-001 = smd 2.54 x 5.08: +$1 -11.43,0; +$2 11.43,0 | smd 10.16 x 10.16: - 0,0
C0805 = smd 1.3 x 1.5: 1 -0.95,0; 2 0.95,0
2.6X1.6X1(BXCXA) = smd 2.6 x 1.6: 1 1.8,0; 2 -1.8,0
4.2X1.9X2.8(BXCXA) = smd 4.2 x 1.9: 1 3.5,0; 2 -3.5,0
SOD123 = smd 1.4 x 1.4: A 1.9,0; C -1.9,0
TRACE_ANTENNA_2.4GHZ_25.7MM = smd 0.46 x 0.46: ANT 0,0.23 | smd 1 x 0.46: GND -1.18,0.23; GND2 -3.38,0.23
TSW-106-XX-G-S = drill 1 pad 1.5 octagon: 1 6.35,0; 2 3.81,0; 3 1.27,0; 4 -1.27,0; 5 -3.81,0; 6 -6.35,0
TSW-102-XX-G-S = drill 1 pad 1.5 octagon: 1 1.27,0; 2 -1.27,0
SOIC127P600X175-16N = smd 1.525 x 0.65: 1 -2.712,4.445; 2 -2.712,3.175; 3 -2.712,1.905; 4 -2.712,0.635; 5 -2.712,-0.635; 6 -2.712,-1.905; 7 -2.712,-3.175; 8 -2.712,-4.445; 9 2.712,-4.445; 10 2.712,-3.175; 11 2.712,-1.905; 12 2.712,-0.635; 13 2.712,0.635; 14 2.712,1.905; 15 2.712,3.175; 16 2.712,4.445
QFN50P400X400X95-21N = smd 0.85 x 0.3: 1 -1.95,1; 2 -1.95,0.5; 3 -1.95,0; 4 -1.95,-0.5; 5 -1.95,-1; 11 1.95,-1; 12 1.95,-0.5; 13 1.95,0; 14 1.95,0.5; 15 1.95,1 | smd 0.3 x 0.85: 6 -1,-1.95; 7 -0.5,-1.95; 8 0,-1.95; 9 0.5,-1.95; 10 1,-1.95; 16 1,1.95; 17 0.5,1.95; 18 0,1.95; 19 -0.5,1.95; 20 -1,1.95 | smd 2.7 x 2.7: 21 0,0
SOTFL50P160X60-6N = smd 0.475 x 0.3: 1 -0.838,0.5; 2 -0.838,0; 3 -0.838,-0.5; 4 0.838,-0.5; 5 0.838,0; 6 0.838,0.5
43045-0600 = drill 1.07 pad 1.63: 1 -3,4.32; 2 0,4.32; 3 3,4.32; 4 3,7.32; 5 0,7.32; 6 -3,7.32 | hole 3: 0,0
2X03 = drill 1.016 octagon: 1 -2.54,-1.27; 2 -2.54,1.27; 3 0,-1.27; 4 0,1.27; 5 2.54,-1.27; 6 2.54,1.27
2X04 = drill 1.016 octagon: 1 -3.81,-1.27; 2 -3.81,1.27; 3 -1.27,-1.27; 4 -1.27,1.27; 5 1.27,-1.27; 6 1.27,1.27; 7 3.81,-1.27; 8 3.81,1.27
G5V1 = drill 0.813 long: 1 -5.08,-2.54; 2 -2.54,-2.54; 5 5.08,-2.54; 6 5.08,2.54; 9 -2.54,2.54; 10 -5.08,2.54
L2012C = smd 1 x 1: 1 -1,0; 2 1,0
INDC3225X200N = smd 1.35 x 2.8: 1 -1.4,0; 2 1.4,0
CHIPLED_0805 = smd 1.2 x 1.2: A 0,-1.05; C 0,1.05
B3FS-1000P = smd 1.6 x 1.4: 1 4,-2.25; 2 -4,-2.25; 3 4,2.25; 4 -4,2.25
HC49/S = drill 0.813: 1 -2.413,0; 2 2.413,0
SUPER-SOT3 = smd 1 x 1.4: 1 -0.95,-1.1; 2 0.95,-1.1; 3 0,1.1
HC49UP = smd 5.334 x 1.93: 1 -4.826,0; 2 4.826,0
R0805 = smd 1.3 x 1.5: 1 -0.95,0; 2 0.95,0
SJ = smd 1.168 x 1.6: 1 -0.762,0; 2 0.762,0
B1,27 = smd 1.27 x 1.27: TP 0,0
TQFP-32 = smd 1.5 x 0.57: 1 -4.13,2.8; 2 -4.13,2; 3 -4.13,1.2; 4 -4.13,0.4; 5 -4.13,-0.4; 6 -4.13,-1.2; 7 -4.13,-2; 8 -4.13,-2.8; 17 4.13,-2.8; 18 4.13,-2; 19 4.13,-1.2; 20 4.13,-0.4; 21 4.13,0.4; 22 4.13,1.2; 23 4.13,2; 24 4.13,2.8 | smd 0.57 x 1.5: 9 -2.8,-4.13; 10 -2,-4.13; 11 -1.2,-4.13; 12 -0.4,-4.13; 13 0.4,-4.13; 14 1.2,-4.13; 15 2,-4.13; 16 2.8,-4.13; 25 2.8,4.13; 26 2,4.13; 27 1.2,4.13; 28 0.4,4.13; 29 -0.4,4.13; 30 -1.2,4.13; 31 -2,4.13; 32 -2.8,4.13
3,2 = hole 3.2: 0,0
PAK100/2500-10 = drill 1 pad 1.422: 1 -5.08,-1.27; 2 -5.08,1.27; 3 -2.54,-1.27; 4 -2.54,1.27; 5 0,-1.27; 6 0,1.27; 7 2.54,-1.27; 8 2.54,1.27; 9 5.08,-1.27; 10 5.08,1.27
RESONATOR-SMD-3.2X1.3 = smd 0.45 x 1.905: 1 -1.2,0; 2 0,0; 3 1.2,0

### Placement (x,y rotation side)
ANT1  18.11,2.13 0 top
B1  53,12 0 bottom
B2  27,12 0 bottom
C1  109.22,46.99 180 top
C2  135.89,13.97 90 top
C3  128.27,22.86 270 top
C4  125.73,22.86 90 top
C5  123.19,22.86 90 top
C6  133.35,13.97 270 top
C7  90.68,13.97 0 top
C8  143.51,57.15 180 top
C9  154.94,41.91 0 top
C10  154.94,44.45 0 top
C11  154.94,39.37 0 top
C12  154.94,36.83 0 top
C13  144.78,46.99 90 top
C14  142.24,46.99 90 top
C15  139.7,46.99 90 top
C16  134.62,30.48 0 top
C17  152.4,30.48 180 top
C18  96.52,13.97 0 top
C19  106.68,31.88 180 top
C20  106.68,27.3 0 top
C21  90.68,19.05 0 top
C22  40.01,4.83 0 top
C23  46.99,19.05 0 top
C24  15.87,7.4 0 top
C25  20.25,7.4 180 top
C26  15.87,13.75 180 top
C27  15.87,11.6 180 top
C28  29.64,7 270 top
C29  32,5 90 top
C30  24,9 270 top
C31  17.8,15.88 0 top
C32  26.18,15.91 180 top
D1  90.68,24.13 180 top
D2  90.68,26.67 180 top
E1  160.53,41.91 270 top
FTDI  92.71,5.08 180 top
I2C  78.74,5.08 180 top
IC1  125.73,15.24 270 top
IC2  28,12 180 top
IC3  143.51,40.64 0 top
IC4  96.52,16.51 0 top
J2  37.72,60.71 0 top
JP1  107.95,6.35 0 top
JP8  128.27,64.77 180 top
K1  15.24,62.23 270 top
K2  24.13,62.23 270 top
L1  148.59,40.64 270 top
L2  151.13,38.1 270 top
L3  151.13,43.18 270 top
L4  96.52,10.67 180 top
L5  21.13,10.87 90 top
L6  19,12 90 top
L7  15.88,9.54 180 top
LED1  22.23,53.34 0 top
LED2  13.34,53.34 0 top
POWER  86.36,35.56 180 top
Q1  143.51,30.48 0 top
Q2  16.38,53.34 0 top
Q3  90.68,30.1 90 top
Q4  25.27,53.34 0 top
Q5  22,20 180 top
R1  118.11,13.97 270 top
R2  115.57,13.97 270 top
R3  96.52,29.21 180 top
R4  96.52,34.29 180 top
R5  96.52,31.75 180 top
R6  96.52,26.67 180 top
R7  111.76,31.88 180 top
R8  147.32,46.99 90 top
R9  143.51,35.05 0 top
R10  76.45,7.62 180 top
R11  81.03,7.62 0 top
R12  106.68,29.59 0 top
R13  96.52,24.13 180 top
R14  96.52,21.59 180 top
R15  96.52,19.05 0 top
R16  24.13,46.99 180 top
R17  24.13,49.53 180 top
R18  15.24,46.99 0 top
R19  15.24,49.53 0 top
R20  32.13,18.41 90 top
R21  49.15,10.16 0 top
R22  26.25,7 270 top
R23  22,15.89 180 top
R_FTDI  40.01,22.65 0 top
R_RESET  49.15,12.45 180 top
RESET  98.71,39.44 180 top
S1  59,17 0 top
S2  59,7 180 top
SJ1  106.68,25.02 180 top
TP1  29.21,41.91 0 top
TP2  25.4,41.91 0 top
TP3  90.17,9.14 0 top
U1  40,12 270 top
U2  109.22,39.37 90 top
U$1  [3,2]  5,5 0 top
U$2  [3,2]  5,65 0 top
U$3  [3,2]  163,65 0 top
U$4  [3,2]  163,15 0 top
U$5  [OSHW-LOGO-L]  150,20 0 top
X1  125.73,6.35 0 top
Y1  111.76,29.59 0 top
Y2  34.67,18.41 270 top

### Tracks (layer width: path | path; a pad name or v marks a point on that pad's centre or on a via)
BAT
  Top 0.305: Q2.2 18.98,52.24 19.68,51.54 19.68,45.34 20.57,44.45 29.21,44.45 | 29.21,44.45 33.02,44.45 | Q4.2 26.39,52.07 33.02,52.07 | TP1.TP 29.21,44.45
  Top 0.508: J2.1 33.02,63.33 33.02,52.07 33.02,44.45 33.02,41.91 34.29,40.64 91.44,40.64 92.71,39.37 92.71,37.85 | Q3.2 92.71,31.98 92.71,34.29 | 92.71,34.29 92.71,37.85 | POWER.2 92.67,37.81 92.71,37.85 | R4.2 92.71,34.29
CE  (via drill 0.35)
  Top 0.305: IC3.1 139.46,41.64 v138.43,42.67 137.59,43.51 134.77,43.51 131.52,46.76 131.52,62.23 130.81,62.94 130.81,64.77 JP8.3 | U2.12 117.71,38.97 119.38,40.64 v119.38,43.18
  Bottom 0.305: v138.43,42.67 119.89,42.67 v119.38,43.18
CSN  (via drill 0.35)
  Top 0.305: IC3.2 138.95,41.14 v138.43,41.66 137.03,43.05 134.58,43.05 131.06,46.57 131.06,61.98 JP8.4 | U2.13 116.86,39.77 118.11,41.02 v118.11,42.16
  Bottom 0.305: v138.43,41.66 118.62,41.66 v118.11,42.16
DTR  (via drill 0.35)
  Top 0.305: SJ1.2 101.73,25.02 v101.6,25.15
  Bottom 0.305: FTDI.1 87.63,6.35 100.33,6.35 101.6,7.62 v101.6,25.15
E_LOCK
  Top 0.305: J2.5 36.3,68.03 35.18,69.15 34.26,69.15 33.69,68.58 19.05,68.58 K1.10
E_UNLOCK
  Top 0.305: J2.6 27.39,68.03 K2.10
FTDI_VCC
  Top 0.305: FTDI.4 92.71,6.35 87.63,6.35 86.36,7.62 86.36,22.86 87.63,24.13 D1.A
GND  (via drill 0.35, 0.5)
  Top 1.016: E1.GND 160.11,43.09 | E1.GND2 160.1,45.29
  other vias: 140.34,38.73 116.84,19.05 116.84,33.02 111.76,26.67 96.52,15.62 87.63,16.51 111.76,39.37 104.14,16.51 104.14,34.29 140.34,42.55
  pour Top: -1,71 -1,-1 10,-1 10,22 15,27 65,27 70,22 70,-1 160.4,-1 160.4,41.1 156.6,41.1 156.6,42.7 160.4,42.7 160.4,71
  pour Bottom: -1,71 -1,-1 10,-1 10,22 15,27 65,27 70,22 70,-1 160.4,-1 160.4,41.1 156.6,41.1 156.6,42.7 160.4,42.7 160.4,71
GND1  (via drill 0.35)
  other vias: 40.01,18.41 42.55,18.41 45.09,20.95 44.45,7.62 31.5,8.38 35,6 27.18,4.83 22.61,7.37 24,6.6 15,16
  pour Top: 13,23 13,6 13.03,5.97 24.64,5.97 24.64,0 66,0 67,1 67,23 66,24 14,24
  pour Bottom: 13,23 13,6 13.03,5.97 24.64,5.97 24.64,0 66,0 67,1 67,23 66,24 14,24
INT  (via drill 0.35)
  Top 0.305: JP8.8 124.84,63.5 126.37,61.98 127.4,61.98 129.24,60.14 129.24,45.81 133.82,41.22 134.85,41.22 138.15,37.92 142.06,37.92 142.51,38.37 IC3.6 | U2.32 108.71,36.57 109.22,37.08 v109.22,40.64
  Bottom 0.305: JP8.8 110.49,63.5 109.22,62.23 v109.22,40.64
MISO  (via drill 0.35)
  Top 0.305: IC3.5 139.46,39.64 v138.43,38.61 135.36,41.68 134.01,41.68 129.69,46 129.69,60.33 127.59,62.43 126.56,62.43 125.73,63.26 125.73,64.77 JP8.7 | JP1.1 106.68,6.35 106.68,8.89 107.49,9.7 107.49,18.1 119.38,29.98 v119.38,38.61 | U2.16 v115.56,42.17 v115.57,42.16
  Bottom 0.305: v138.43,38.61 v119.38,38.61 116.33,38.61 115.57,39.37 v115.57,42.16
MOSI  (via drill 0.35)
  Top 0.305: IC3.4 138.95,40.14 v138.43,39.62 135.91,42.14 134.2,42.14 130.15,46.19 130.15,60.52 127.17,63.5 JP8.6 | JP1.4 107.95,17.91 120.65,30.61 v120.65,39.62 | U2.15 116.3,41.37 116.84,41.91 v116.84,43.18
  Bottom 0.305: v138.43,39.62 v120.65,39.62 117.86,39.62 116.84,40.64 v116.84,43.18
N$1
  Top 0.305: C1.1 110.17,45.53 109.62,44.98 U2.20
N$2
  Top 0.305: Y1.1 110.56,31.63 R7.2 110.81,33.47 111.22,33.88 U2.7
N$3
  Top 0.305: Y1.3 112.96,31.63 R7.1 112.71,33.21 112.02,33.9 U2.8
N$4  (via drill 0.35)
  Top 0.305: U2.31 107.41,37.37 v107.44,37.34 | v118.11,19.05 R1.1
  Bottom 0.305: v107.44,37.34 118.11,26.67 v118.11,19.05
N$5  (via drill 0.35)
  Top 0.305: U2.30 106.61,38.17 v106.68,38.1 | v115.57,19.05 R2.1
  Bottom 0.305: v106.68,38.1 106.68,36.88 115.57,27.99 v115.57,19.05
N$6
  Top 0.305: IC1.6 123.83,19.68 123.19,20.32 C5.1
N$7
  Top 0.305: IC1.1 130.18,19.18 129.29,20.07 128.52,20.07 128.27,20.32 C3.2
N$8
  Top 0.305: IC1.5 125.09,19.68 124.46,20.32 124.46,23.5 124.78,23.81 C4.2
N$9
  Top 0.305: IC1.3 127.64,19.68 127,20.32 127,23.37 127.44,23.81 C3.1
N$10
  Top 0.305: IC1.4 126.36,19.68 125.73,20.32 C4.1
N$11
  Top 0.305: IC1.2 128.91,15.88 129.86,14.92 C6.1
N$12
  Top 0.305: X1.3 121.92,6.35 120.02,6.35 119.38,6.99 119.38,8.26 120.52,9.4 125.98,9.4 126.36,9.78 IC1.13
N$13
  Top 0.305: X1.2 121.92,8.89 127,8.89 127.64,9.53 IC1.14
N$14  (1 unrouted)
  Top 0.305: IC3.13 148.21,40.64 148.59,41.02 L1.1 148.59,43.18 149.59,44.18 L3.1
N$15  (1 unrouted)
  Top 0.305: IC3.12 148.09,40.14 L1.2 150.59,39.64 L2.1
N$16
  Top 0.305: IC3.11 147.16,39.64 147.96,38.84 149.4,38.84 L2.2 153.72,37.1 C12.1 C11.1
N$17
  Top 0.305: L3.2 151.4,41.91 C9.1
N$18
  Top 0.305: C9.2 C10.2
  Top 0.508: E1.ANT C9.2
N$19
  Top 0.305: IC3.19 143.01,44.46 143.3,44.75 144.57,44.75 144.78,44.96 C13.1
N$20
  Top 0.508: R20.2 32.38,19.61 Y2.1 37.28,19.61 38,18.9 U1.7
N$21
  Top 0.305: C16.2 Q1.1 142.56,31.94 R9.1 142.56,36.01 143,36.45 143.51,36.45 144.01,36.95 IC3.9
N$22
  Top 0.305: C17.2 Q1.2 144.46,31.94 R9.2 144.51,35.1 IC3.10
N$23
  Top 0.305: IC3.16 144.51,43.16 144.91,43.56 146.81,43.56 147.32,44.07 R8.1
N$24
  Top 0.305: IC4.2 95.25,16.51 95.12,16.38 95.12,14.42 C18.1 95.57,13.4 97.92,11.05 L4.1
N$25
  Top 0.305: IC4.4 97.47,15.9 C18.2
N$26
  Top 0.305: R13.2 R14.2
N$27
  Top 0.305: IC4.5 96.52,16.51 96.02,17.01 IC4.1 93.48,17.01 92.48,18.01 C21.1 92.58,19.15 D1.C D2.C
N$28
  Top 0.305: SJ1.1 107.63,25.21 C20.2
N$29
  Bottom 0.508: K1.5 K1.6 K2.5 K2.6 39.37,57.15 40.72,58.5 J2.3
N$30
  Top 0.305: R6.1 R13.1
N$31
  Top 0.305: R14.1 R15.2 97.47,17.01 IC4.6
N$32
  Top 0.508: U1.8 37.2,16.77 36.76,17.21 Y2.3 32.38,17.21 R20.1
N$33
  Top 0.305: D2.A 88.78,30.1 | 88.78,30.1 88.78,32.9 89.19,33.31 POWER.4 | Q3.3 88.78,30.1
N$34
  Top 0.305: K1.2 13.97,64.77 15.24,63.5 15.24,55.58 Q2.3
N$35
  Top 0.305: K2.2 22.86,64.77 24.13,63.5 24.13,55.58 Q4.3
N$36
  Top 0.508: U1.20 39.6,5.37 C22.1
N$37
  Top 0.305: LED1.A 22.23,50.48 R17.2
N$38
  Top 0.305: U1.1 53.62,16.13 S1.2
N$39
  Top 0.305: LED2.A 13.34,50.48 R19.1
N$40
  Top 0.305: U1.32 51.24,14.8 52.07,13.97 52.07,10.29 53.11,9.25 S2.1
N$41
  Top 0.305: R_FTDI.1 47.94,21.07 C23.2
N$42  (via drill 0.35)
  Top 0.305: C23.1 46.04,17.59 v46.48,17.14 | U1.29 46.44,12.4 v46.48,12.45 48.26,12.45 | 48.26,12.45 R_RESET.2 | R21.1 48.26,10.22 48.26,12.45
  Bottom 0.305: v46.48,17.14 v46.48,12.45
N$43
  Top 0.305: IC2.13 22.12,12 21.93,11.81 21.93,10.3 21.51,9.87 L5.1 20.8,9.54 L7.1
N$44  (via drill 0.35)
  Top 0.305: U1.31 45.53,14 v45.65,14.12
  Bottom 0.305: v45.65,14.12 43.81,15.95 R_FTDI.2
N$45  (via drill 0.35)
  Top 0.305: U1.30 v45.59,13.2 v45.59,13.21
  Bottom 0.305: v45.59,13.21 43.56,15.24 42.29,15.24 41.27,16.26 R_FTDI.3
N$46
  Top 0.305: IC2.12 21.75,12.5 L5.2 20.25,11 L6.1
N$47
  Top 0.305: 16.79,11.64 C27.1 17.59,11.6 18,12.02 18,13 | IC2.11 L6.2 18,13 | C26.1 17.62,13.75 18,13.37 18,13
N$48
  Top 0.305: L7.2 14.92,9.5 C24.1
N$49
  Top 0.305: C25.2 C24.2 16.82,6.16 14.81,4.14 ANT1.1
N$50
  Top 0.305: IC2.9 27.5,14.53 27.18,14.86 26.35,14.86 25.65,14.86 25.23,15.29 C32.2 | C32.2 22.97,15.91 R23.1 | Q5.1 25.23,18.4 C32.2
N$51
  Top 0.305: Q5.2 18.75,18.43 C31.2 R23.2 21.05,14.95 21.67,14.33 26.62,14.33 IC2.10
N$52
  Top 0.305: IC2.16 27,9.22 26.25,8.47 R22.1
N$53
  Top 0.305: IC2.19 28.5,9.35 28.83,9.02 29.21,9.02 29.64,8.59 C28.1
N$54
  Top 0.305: IC2.3 30.87,12 35,7.87 U1.17
N$55  (via drill 0.35)
  Top 0.305: v32.61,11.42 32.93,11.42 35.2,9.16 35.83,9.16 U1.16 | v33,13 IC2.5
  Bottom 0.305: v32.61,11.42 32.61,12.61 v33,13
N$56
  Top 0.305: U1.15 35,10 32.5,12.5 IC2.4
N$57  (via drill 0.35)
  Top 0.305: IC2.2 30.73,11.5 33.53,8.7 v33.53,8.38 | v34.42,11.56 34.46,11.6 U1.13
  Bottom 0.305: v33.53,8.38 33.53,10.67 v34.42,11.56
N$58  (via drill 0.35)
  Top 0.305: 35.8,12.33 U1.12 35.79,12.32 v33.78,12.32 | IC2.1 30.46,11 32.51,8.95 v32.51,8.38
  Bottom 0.305: v32.51,8.38 32.51,10.36 33.29,11.14 33.29,11.83 v33.78,12.32
RESET  (via drill 0.35)
  Top 0.305: C20.1 R12.1 v102.87,29.59 102.71,29.75 RESET.4 102.71,38.57 103.11,38.97 U2.29
  Bottom 0.305: JP1.5 109.22,3.81 104.03,3.81 102.87,4.97 v102.87,29.59
RX-I  (via drill 0.35)
  Top 0.305: R2.2 115.57,11.43 116.33,10.67 124.59,10.67 125.09,11.18 IC1.12 125.09,14.86 124.21,15.75 v123.19,15.75
  Bottom 0.305: v123.19,15.75 122.63,15.19 116.14,15.19 115.11,14.16 115.11,2.79 114.05,1.73 92.25,1.73 91.44,2.54 FTDI.3
S_LOCK  (via drill 0.35)
  Top 0.305: Q2.1 16.19,51.48 R19.2 R18.2 v17.78,46.99 | U2.10 116.3,37.37 v117.47,36.2
  Bottom 0.305: v117.47,36.2 117.09,36.58 111.25,36.58 101.3,46.53 28.75,46.53 27.94,45.72 19.05,45.72 v17.78,46.99
S_POWER
  Top 0.305: Q3.1 95.51,29.15 R3.2 95.57,28.25 95.89,27.94 99.06,27.94 100.33,26.67 100.33,24.13 101.6,22.86 110.19,22.86 115.57,28.24 115.57,35.56 114.56,36.57 U2.9
S_UNLOCK  (via drill 0.35)
  Top 0.305: Q4.1 25.08,51.48 R17.1 R16.1 v27.94,46.99 | U2.11 116.77,38.17 v117.47,37.47
  Bottom 0.305: v117.47,37.47 117.09,37.08 111.51,37.08 101.6,46.99 v27.94,46.99
SCK  (via drill 0.35)
  Top 0.305: IC3.3 v138.43,40.64 136.47,42.6 134.39,42.6 130.61,46.38 130.61,60.83 128.27,63.17 128.27,64.77 JP8.5 | U2.17 112.02,44.46 112.39,44.83 121.03,44.83 121.92,43.94 v121.92,40.64 121.92,31.23 108.41,17.72 108.41,9.7 109.22,8.89 109.22,6.35 JP1.3
  Bottom 0.305: v121.92,40.64 v138.43,40.64
SCL  (via drill 0.35)
  Top 0.305: R10.1 77.47,7.55 I2C.1 | U2.28 98.66,39.77 v97.79,40.64
  Bottom 0.305: v97.79,40.64 80.26,40.64 78.36,38.73 78.36,5.97 I2C.1
SDA  (via drill 0.35)
  Top 0.305: R11.1 80.01,7.55 I2C.2 | U2.27 99.13,40.57 v99.06,40.64
  Bottom 0.305: v99.06,40.64 98.76,40.64 98.07,39.96 80.6,39.96 79.12,38.48 79.12,5.97 I2C.2
TX-O  (via drill 0.35)
  Top 0.305: R1.2 118.11,11.43 118.36,11.18 123.57,11.18 123.83,11.43 IC1.11 123.83,14.1 v123.19,14.73
  Bottom 0.305: v123.19,14.73 116.33,14.73 115.57,13.97 115.57,2.54 114.3,1.27 90.17,1.27 88.9,2.54 FTDI.2
V_SENSE  (via drill 0.35)
  Top 0.305: R5.2 95.57,32.7 95.89,33.02 97.16,33.02 97.47,33.34 R4.1 v99.06,34.29 | U2.23 107.22,45.18 106.68,45.72 v100.33,45.72
  Bottom 0.305: v99.06,34.29 100.33,35.56 v100.33,45.72
VCC  (via drill 0.35)
  Top 0.305: IC3.15 146.54,41.64 v146.69,41.78 | IC3.7 143.01,38.11 141.73,36.83 v140.97,36.83 | IC3.18 143.51,43.89 v143.69,44.07 | 110.49,35.17 U2.6 | R6.2 v93.98,26.67
  Top 0.508: C14.1 140.97,44.77 | 140.97,44.77 v140.97,44.07 135,44.07 132.08,46.99 132.08,57.15 | C15.1 140.97,44.77 | 132.08,57.15 JP8.2 | JP1.2 102.87,7.62 | 102.87,7.62 102.87,2.54 | 81.98,2.54 102.87,2.54 | R11.2 81.98,2.54 | C19.1 109.22,31.88 | 109.22,31.88 v109.22,29.59 R12.2 | 109.22,31.88 109.22,33.02 | 109.22,33.02 108.82,33.42 U2.4 | 109.22,33.02 110.42,34.22 U2.6 110.42,41.84 111.22,42.64 U2.18 | IC1.16 131.91,12.53 132.4,13.02 C6.2 C2.1 138.37,13.02 v138.43,13.08 138.43,3.81 137.16,2.54 102.87,2.54 | C7.1 v92.48,10.67 | v92.48,10.67 L4.2 | v92.48,10.67 92.48,9.12 | 92.48,9.12 93.98,7.62 102.87,7.62 | R10.2 75.5,3.24 76.2,2.54 81.98,2.54 | C8.1 132.08,57.15 | TP3.TP 90.19,9.12 92.48,9.12
  Bottom 0.305: v93.98,26.67 93.98,12.17 v92.48,10.67
  Bottom 0.508: 140.84,44.07 v140.97,44.07 v143.69,44.07 145.92,44.07 146.69,43.31 v146.69,41.78 146.69,37.97 145.54,36.83 v140.97,36.83 139.7,36.83 138.43,35.56 v138.43,13.08 | JP1.2 106.68,8.89 107.95,8.89 109.22,10.16 v109.22,29.59
VCC/2  (via drill 0.35)  (2 unrouted)
  Top 0.305: v42.04,6.35 49.02,6.35 50.1,7.43 R21.2 | IC2.18 28,4 | 28,4 31.95,4 C29.1 35.55,4.05 v37.47,5.97 | IC2.15 25.15,10.1 | 28,4 26,4 25.15,4.85 25.15,10.1 | C30.1 24.15,10.1 25.15,10.1 | IC2.7 28.5,16.69 v29.46,17.65
  Top 0.508: U1.4 40.4,14.87 40.13,14.61 | 40.13,14.61 39.12,14.61 38.8,14.92 U1.6 38.8,22.59 R_FTDI.4 | U1.18 38,6.5 v37.47,5.97 | v42.04,6.35 42,6.39 U1.23 42,12.74 40.13,14.61
  Bottom 0.305: v29.46,17.65 38.73,17.65
  Bottom 0.508: R_FTDI.4 38.73,17.65 38.73,12.3 B2.+$1 38.43,6.93 v37.47,5.97 | v42.04,6.35 41.57,6.82 B1.+$2
  Bottom 2.54: B2.+$1 B1.+$2

### Text on the board
tPlace: github.com/ / olback/car-key
tNames: Central Comfort / Module Connector | GND | BAT | FTDI | VCC | DTR | TX | RX | VIN | GND | GND | SCL | SDA